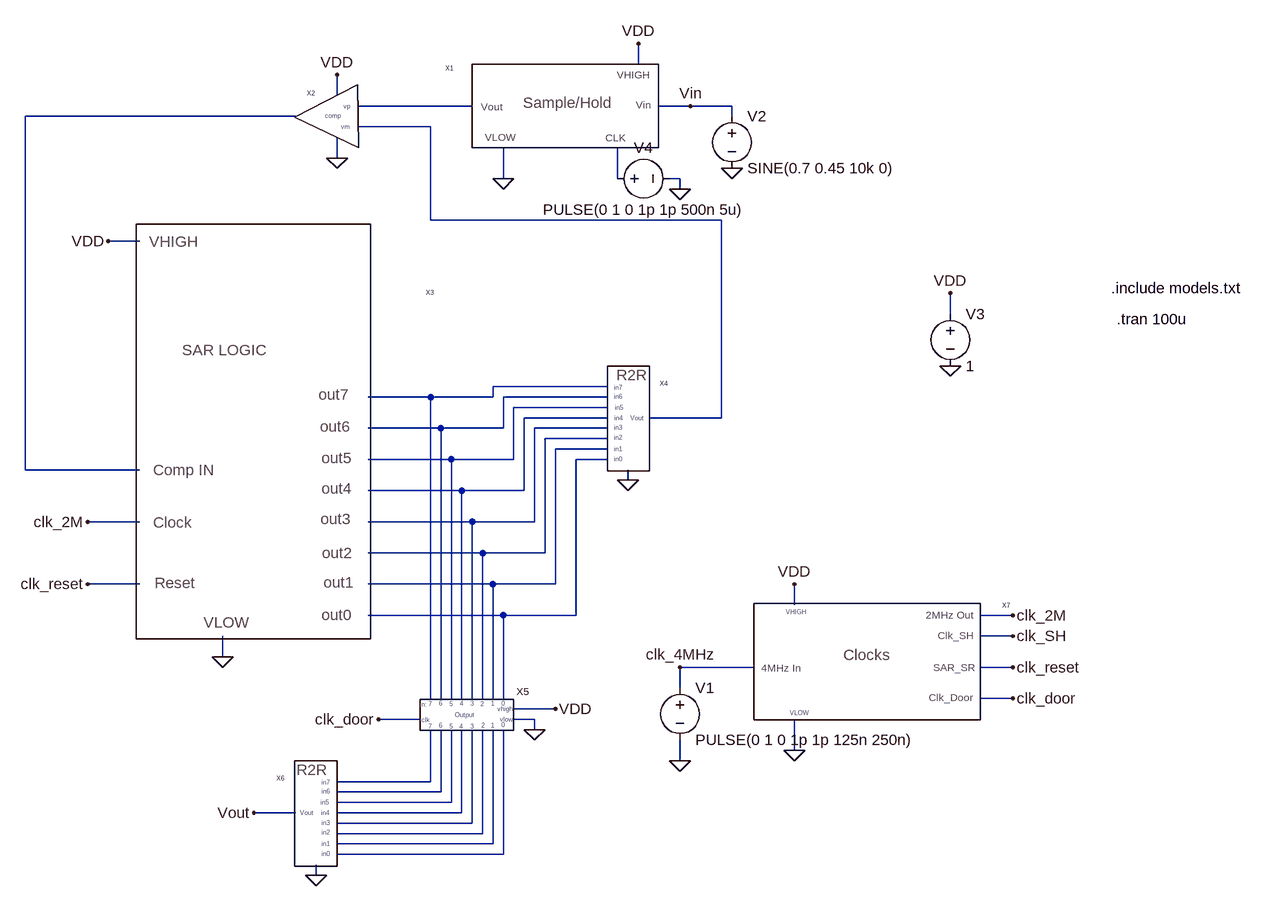
[diagram p0: schematic SAR-ADC.asc]
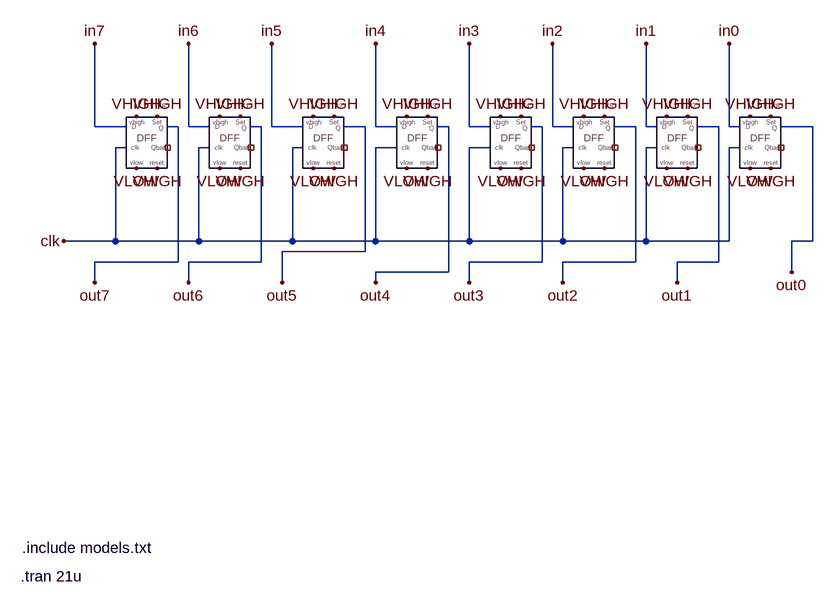
[diagram p1: sub-circuit outputdoor.asc]
SAR-ADC.asc, the LTspice schematic file:
Version 4
SHEET 1 1304 1284
WIRE 352 16 352 -16
WIRE -112 64 -112 32
WIRE 96 80 -80 80
WIRE 432 80 384 80
WIRE 496 80 432 80
WIRE -176 96 -592 96
WIRE 496 96 496 80
WIRE 32 112 -80 112
WIRE -112 160 -112 128
WIRE 144 192 144 144
WIRE 320 192 320 144
WIRE 416 192 400 192
WIRE 416 208 416 192
WIRE 32 256 32 112
WIRE 480 256 32 256
WIRE -416 288 -464 288
WIRE 832 400 832 368
WIRE 304 512 128 512
WIRE 32 528 -64 528
WIRE 128 528 128 512
WIRE 128 528 32 528
WIRE 304 528 144 528
WIRE 304 544 160 544
WIRE 304 560 176 560
WIRE 480 560 480 256
WIRE 480 560 368 560
WIRE 48 576 -64 576
WIRE 144 576 144 528
WIRE 144 576 48 576
WIRE 304 576 192 576
WIRE 304 592 208 592
WIRE 304 608 224 608
WIRE 64 624 -64 624
WIRE 160 624 160 544
WIRE 160 624 64 624
WIRE 304 624 256 624
WIRE -592 640 -592 96
WIRE -416 640 -592 640
WIRE 336 656 336 640
WIRE 80 672 -64 672
WIRE 176 672 176 560
WIRE 176 672 80 672
WIRE -416 720 -496 720
WIRE 96 720 -64 720
WIRE 192 720 192 576
WIRE 192 720 96 720
WIRE 112 768 -64 768
WIRE 208 768 208 592
WIRE 208 768 112 768
WIRE -416 816 -496 816
WIRE 128 816 -64 816
WIRE 224 816 224 608
WIRE 224 816 128 816
WIRE 592 848 592 816
WIRE 144 864 -64 864
WIRE 256 864 256 624
WIRE 256 864 144 864
WIRE 928 864 880 864
WIRE 928 896 880 896
WIRE -288 928 -288 896
WIRE 528 944 416 944
WIRE 928 944 880 944
WIRE 416 976 416 944
WIRE 32 992 32 528
WIRE 48 992 48 576
WIRE 64 992 64 624
WIRE 80 992 80 672
WIRE 96 992 96 720
WIRE 112 992 112 768
WIRE 128 992 128 816
WIRE 144 992 144 864
WIRE 928 992 880 992
WIRE 224 1008 160 1008
WIRE 16 1024 -48 1024
WIRE 192 1024 160 1024
WIRE 192 1040 192 1024
WIRE 592 1072 592 1024
WIRE 416 1088 416 1056
WIRE 32 1120 32 1040
WIRE 32 1120 -112 1120
WIRE 48 1136 48 1040
WIRE 48 1136 -112 1136
WIRE 64 1152 64 1040
WIRE 64 1152 -112 1152
WIRE -176 1168 -240 1168
WIRE 80 1168 80 1040
WIRE 80 1168 -112 1168
WIRE 96 1184 96 1040
WIRE 96 1184 -112 1184
WIRE 112 1200 112 1040
WIRE 112 1200 -112 1200
WIRE 128 1216 128 1040
WIRE 128 1216 -112 1216
WIRE 144 1232 144 1040
WIRE 144 1232 -112 1232
WIRE -144 1264 -144 1248
FLAG 336 656 0
FLAG 928 864 clk_2M
FLAG 928 896 clk_SH
FLAG 928 944 clk_reset
FLAG 928 992 clk_door
FLAG 592 1072 0
FLAG 416 1088 0
FLAG 416 944 clk_4MHz
FLAG 592 816 VDD
FLAG -288 928 0
FLAG -496 816 clk_reset
FLAG -496 720 clk_2M
FLAG -464 288 VDD
FLAG 144 192 0
FLAG 496 176 0
FLAG 432 80 Vin
FLAG 352 -16 VDD
FLAG -112 160 0
FLAG -112 32 VDD
FLAG -48 1024 clk_door
FLAG 224 1008 VDD
FLAG 192 1040 0
FLAG -144 1264 0
FLAG -240 1168 Vout
FLAG 832 480 0
FLAG 832 368 VDD
FLAG 416 208 0
SYMBOL sample_hold 288 80 M0
SYMATTR InstName X1
SYMBOL comparator -128 80 M0
SYMATTR InstName X2
SYMBOL SAR_logic -288 416 R0
SYMATTR InstName X3
SYMBOL R2R 320 528 R0
SYMATTR InstName X4
SYMBOL outputdoor 96 1008 R0
SYMATTR InstName X5
SYMBOL R2R -128 1136 M0
SYMATTR InstName X6
SYMBOL Clock_half 640 912 R0
SYMATTR InstName X7
SYMBOL voltage 416 960 R0
WINDOW 123 0 0 Left 0
WINDOW 39 0 0 Left 0
SYMATTR InstName V1
SYMATTR Value PULSE(0 1 0 1p 1p 125n 250n)
SYMBOL voltage 496 80 R0
WINDOW 123 0 0 Left 0
WINDOW 39 0 0 Left 0
SYMATTR InstName V2
SYMATTR Value SINE(0.7 0.45 10k 0)
SYMBOL voltage 832 384 R0
WINDOW 123 0 0 Left 0
WINDOW 39 0 0 Left 0
SYMATTR InstName V3
SYMATTR Value 1
SYMBOL voltage 304 192 R270
WINDOW 0 32 56 VTop 2
WINDOW 3 -32 56 VBottom 2
WINDOW 123 0 0 Left 0
WINDOW 39 0 0 Left 0
SYMATTR InstName V4
SYMATTR Value PULSE(0 1 0 1p 1p 500n 5u)
TEXT 1080 360 Left 2 !.include models.txt
TEXT 1088 408 Left 2 !.tran 100u

outputdoor.asc, the sub-circuit schematic file:
Version 4
SHEET 1 908 820
WIRE -208 112 -208 -16
WIRE -160 112 -208 112
WIRE -80 112 -96 112
WIRE -64 112 -64 -16
WIRE -32 112 -64 112
WIRE 48 112 32 112
WIRE 64 112 64 -16
WIRE 112 112 64 112
WIRE 208 112 176 112
WIRE 224 112 224 -16
WIRE 256 112 224 112
WIRE 336 112 320 112
WIRE 368 112 368 -16
WIRE 400 112 368 112
WIRE 480 112 464 112
WIRE 496 112 496 -16
WIRE 528 112 496 112
WIRE 624 112 592 112
WIRE 640 112 640 -16
WIRE 656 112 640 112
WIRE 752 112 720 112
WIRE 768 112 768 -16
WIRE 784 112 768 112
WIRE 896 112 848 112
WIRE -160 144 -176 144
WIRE -32 144 -48 144
WIRE 112 144 96 144
WIRE 256 144 224 144
WIRE 400 144 368 144
WIRE 528 144 512 144
WIRE 656 144 640 144
WIRE 784 144 768 144
WIRE -176 288 -176 144
WIRE -176 288 -256 288
WIRE -48 288 -48 144
WIRE -48 288 -176 288
WIRE 96 288 96 144
WIRE 96 288 -48 288
WIRE 224 288 224 144
WIRE 224 288 96 288
WIRE 368 288 368 144
WIRE 368 288 224 288
WIRE 512 288 512 144
WIRE 512 288 368 288
WIRE 640 288 640 144
WIRE 640 288 512 288
WIRE 768 288 768 144
WIRE 768 288 640 288
WIRE 896 288 896 112
WIRE 896 288 864 288
WIRE 208 304 208 112
WIRE 208 304 80 304
WIRE -80 320 -80 112
WIRE -80 320 -208 320
WIRE 48 320 48 112
WIRE 48 320 -64 320
WIRE 480 320 480 112
WIRE 480 320 368 320
WIRE 624 320 624 112
WIRE 624 320 512 320
WIRE 752 320 752 112
WIRE 752 320 688 320
WIRE 336 336 336 112
WIRE 336 336 224 336
WIRE 864 336 864 288
WIRE -208 352 -208 320
WIRE -64 352 -64 320
WIRE 80 352 80 304
WIRE 224 352 224 336
WIRE 368 352 368 320
WIRE 512 352 512 320
WIRE 688 352 688 320
FLAG -144 96 VHIGH
FLAG -112 96 VHIGH
FLAG -112 176 VHIGH
FLAG -16 96 VHIGH
FLAG 16 96 VHIGH
FLAG 16 176 VHIGH
FLAG 128 96 VHIGH
FLAG 160 96 VHIGH
FLAG 160 176 VHIGH
FLAG 304 176 VHIGH
FLAG 304 96 VHIGH
FLAG 272 96 VHIGH
FLAG 416 96 VHIGH
FLAG 448 96 VHIGH
FLAG 448 176 VHIGH
FLAG 576 96 VHIGH
FLAG 544 96 VHIGH
FLAG 576 176 VHIGH
FLAG 704 176 VHIGH
FLAG 704 96 VHIGH
FLAG 672 96 VHIGH
FLAG 672 176 VLOW
FLAG 544 176 VLOW
FLAG 416 176 VLOW
FLAG 272 176 VLOW
FLAG 128 176 VLOW
FLAG -16 176 VLOW
FLAG -144 176 VLOW
FLAG -256 288 clk
FLAG 640 -16 in1
FLAG 496 -16 in2
FLAG 368 -16 in3
FLAG 224 -16 in4
FLAG 64 -16 in5
FLAG -64 -16 in6
FLAG -208 -16 in7
FLAG 832 176 VHIGH
FLAG 832 96 VHIGH
FLAG 800 96 VHIGH
FLAG 800 176 VLOW
FLAG 768 -16 in0
FLAG 864 336 out0
FLAG 688 352 out1
FLAG 512 352 out2
FLAG 368 352 out3
FLAG 224 352 out4
FLAG 80 352 out5
FLAG -64 352 out6
FLAG -208 352 out7
SYMBOL DFF 48 128 R0
SYMATTR InstName X1
SYMBOL DFF 192 128 R0
SYMATTR InstName X2
SYMBOL DFF 336 128 R0
SYMATTR InstName X3
SYMBOL DFF 480 128 R0
SYMATTR InstName X4
SYMBOL DFF 608 128 R0
SYMATTR InstName X5
SYMBOL DFF -80 128 R0
SYMATTR InstName X6
SYMBOL DFF 736 128 R0
SYMATTR InstName X7
SYMBOL DFF 864 128 R0
SYMATTR InstName X8
TEXT -322 804 Left 2 !.tran 21u
TEXT -320 760 Left 2 !.include models.txt

The netlist it stands for:
* SAR-ADC.asc
XX1 VDD 0 N004 N001 Vin sample_hold  ; pins VHIGH VLOW clk Vout Sample_IN
XX2 N001 N003 VDD 0 N002 comparator  ; pins vp vm VHIGH VLOW Vout
XX3 N012 N011 N010 N009 N008 N007 N006 N005 clk_reset 0 clk_2M N002 VDD SAR_logic  ; pins out0 out1 out2 out3 out4 out5 out6 out7 Reset VLOW Clk Comp VHIGH
XX4 N003 0 N012 N011 N010 N009 N008 N007 N006 N005 R2R  ; pins Vout VLOW in0 in1 in2 in3 in4 in5 in6 in7
XX5 clk_door N012 N011 N010 N009 N008 N007 N006 N005 N020 N019 N018 N017 N016 N015 N014 N013 VDD 0 outputdoor
XX6 Vout 0 N020 N019 N018 N017 N016 N015 N014 N013 R2R  ; pins Vout VLOW in0 in1 in2 in3 in4 in5 in6 in7
XX7 VDD 0 clk_SH clk_reset clk_door clk_4MHz clk_2M Clock_half  ; pins VHIGH VLOW Clk_SH SAR_SR clk_door clk_in clk_2MHz
V1 clk_4MHz 0 PULSE(0 1 0 1p 1p 125n 250n)
V2 Vin 0 SINE(0.7 0.45 10k 0)
V3 VDD 0 1
V4 N004 0 PULSE(0 1 0 1p 1p 500n 5u)

* block symbol definitions
.subckt outputdoor clk in0 in1 in2 in3 in4 in5 in6 in7 out0 out1 out2 out3 out4 out5 out6 out7 VHIGH VLOW
XX1 in6 clk VHIGH VLOW VHIGH VHIGH out6 NC_01 DFF  ; pins D clk VHIGH VLOW set_b reset_b Q Qbar
XX2 in5 clk VHIGH VLOW VHIGH VHIGH out5 NC_02 DFF  ; pins D clk VHIGH VLOW set_b reset_b Q Qbar
XX3 in4 clk VHIGH VLOW VHIGH VHIGH out4 NC_03 DFF  ; pins D clk VHIGH VLOW set_b reset_b Q Qbar
XX4 in3 clk VHIGH VLOW VHIGH VHIGH out3 NC_04 DFF  ; pins D clk VHIGH VLOW set_b reset_b Q Qbar
XX5 in2 clk VHIGH VLOW VHIGH VHIGH out2 NC_05 DFF  ; pins D clk VHIGH VLOW set_b reset_b Q Qbar
XX6 in7 clk VHIGH VLOW VHIGH VHIGH out7 NC_06 DFF  ; pins D clk VHIGH VLOW set_b reset_b Q Qbar
XX7 in1 clk VHIGH VLOW VHIGH VHIGH out1 NC_07 DFF  ; pins D clk VHIGH VLOW set_b reset_b Q Qbar
XX8 in0 clk VHIGH VLOW VHIGH VHIGH out0 NC_08 DFF  ; pins D clk VHIGH VLOW set_b reset_b Q Qbar
.tran 21u
.include models.txt
.ends outputdoor

.include models.txt
.tran 100u
.backanno
.end